# EAGLE design smarthalo_BRAIN_no_usb (EAGLE 6.5.0)
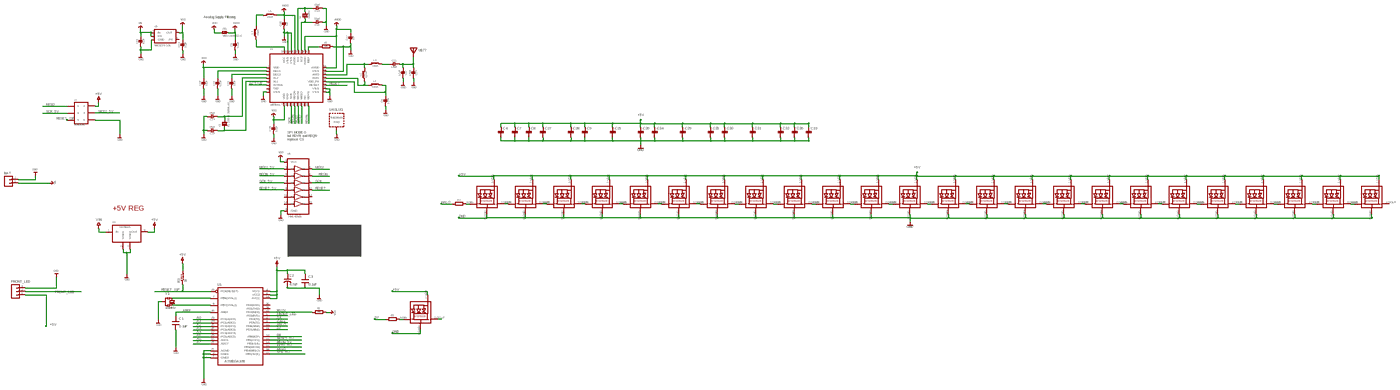
[diagram p0: schematic, sheet 1, overview]
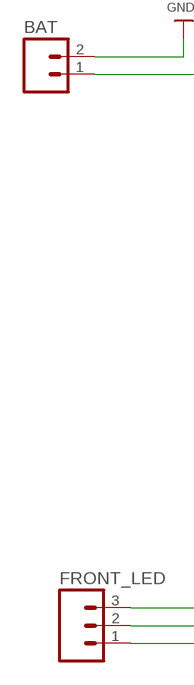
[diagram p1: schematic, sheet 1, part 1 of 4]
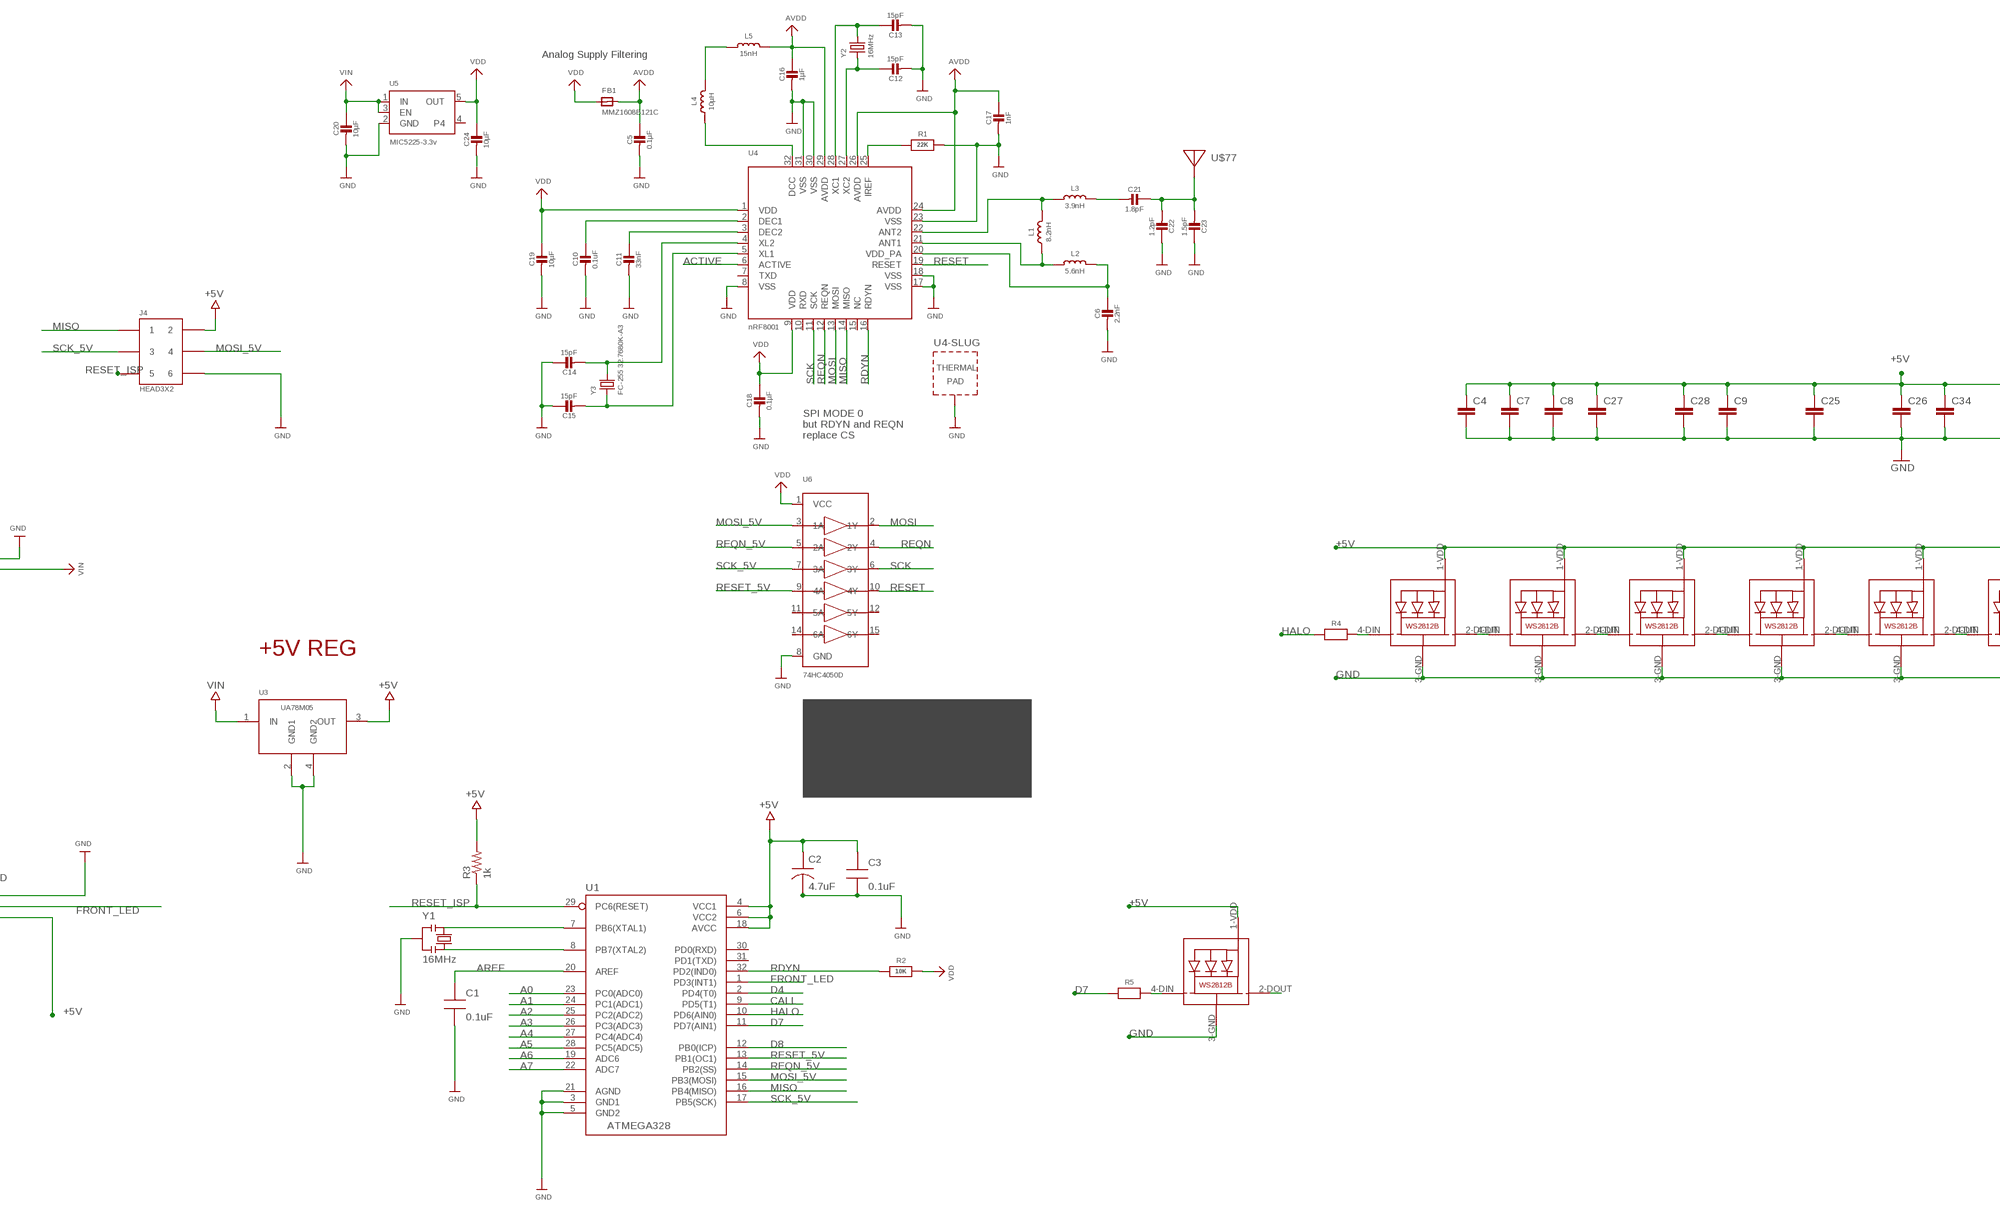
[diagram p2: schematic, sheet 1, part 2 of 4]
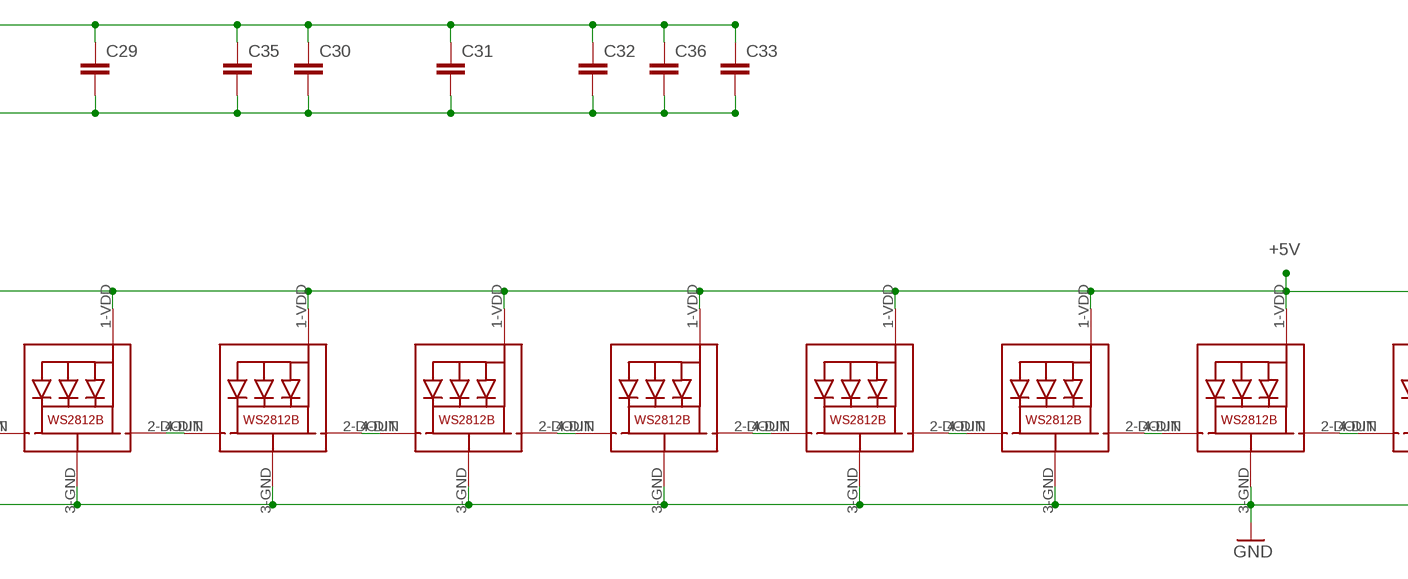
[diagram p3: schematic, sheet 1, part 3 of 4]
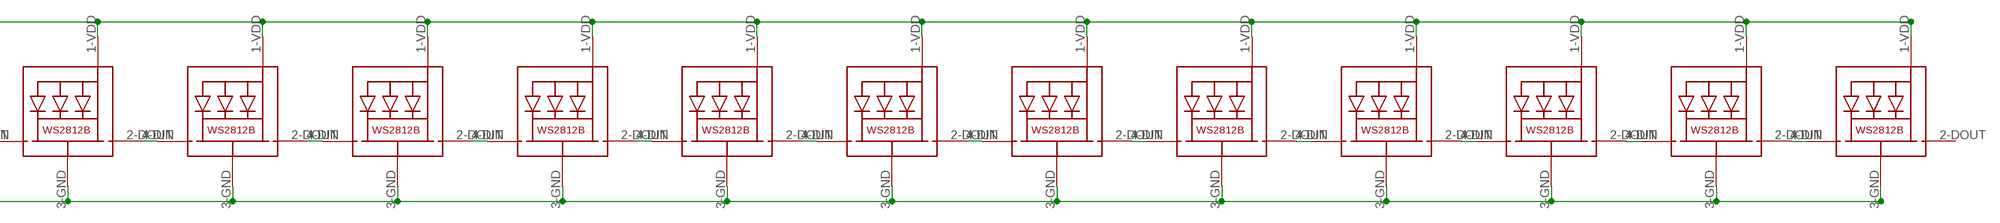
[diagram p4: schematic, sheet 1, part 4 of 4]

## Parts
BAT  M02POLAR_LOCK  [MOLEX-1X2_LOCK]
C1  0.1uF  CAP0805-NP  [CAP0805-NP]
C2  4.7uF  CAP-TANA-P  [TAN-A]
C3  0.1uF  CAP0805-NP  [CAP0805-NP]
C4  C-EUC0603  [C0603]
C5  0.1µF  CAP_CERAMIC0805-NOOUTLINE  [0805-NO]
C6  2.2nF  CAP_CERAMIC_0402  [_0402]
C7  C-EUC0603  [C0603]
C8  C-EUC0603  [C0603]
C9  C-EUC0603  [C0603]
C10  0.1uF  CAP_CERAMIC0805-NOOUTLINE  [0805-NO]
C11  33nF  CAP_CERAMIC0805-NOOUTLINE  [0805-NO]
C12  15pF  CAP_CERAMIC0805-NOOUTLINE  [0805-NO]
C13  15pF  CAP_CERAMIC0805-NOOUTLINE  [0805-NO]
C14  15pF  CAP_CERAMIC0805-NOOUTLINE  [0805-NO]
C15  15pF  CAP_CERAMIC0805-NOOUTLINE  [0805-NO]
C16  1µF  CAP_CERAMIC0805-NOOUTLINE  [0805-NO]
C17  1nF  CAP_CERAMIC_0603  [_0603]
C18  0.1µF  CAP_CERAMIC0805-NOOUTLINE  [0805-NO]
C19  10µF  CAP_CERAMIC0805-NOOUTLINE  [0805-NO]
C20  10µF  CAP_CERAMIC0805-NOOUTLINE  [0805-NO]
C21  1.8pF  CAP_CERAMIC_0402MP  [_0402MP]
C22  1.2pF  CAP_CERAMIC_0402MP  [_0402MP]
C23  1.5pF  CAP_CERAMIC_0402MP  [_0402MP]
C24  10µF  CAP_CERAMIC0805-NOOUTLINE  [0805-NO]
C25  C-EUC0603  [C0603]
C26  C-EUC0603  [C0603]
C27  C-EUC0603  [C0603]
C28  C-EUC0603  [C0603]
C29  C-EUC0603  [C0603]
C30  C-EUC0603  [C0603]
C31  C-EUC0603  [C0603]
C32  C-EUC0603  [C0603]
C33  C-EUC0603  [C0603]
C34  C-EUC0603  [C0603]
C35  C-EUC0603  [C0603]
C36  C-EUC0603  [C0603]
FB1  MMZ1608B121C  FERRITE0805  [0805]
FRONT_LED  M03PTH  [1X03]
J4  HEAD3X2  [HEAD3X2]
L1  8.2nH  INDUCTOR_0402  [_0402]
L2  5.6nH  INDUCTOR_0402  [_0402]
L3  3.9nH  INDUCTOR_0402  [_0402]
L4  10µH  INDUCTOR_0603  [_0603]
L5  15nH  INDUCTOR_0603  [_0603]
LED1  WS2812B5050  [WS2812B]
LED2  WS2812B5050  [WS2812B]
LED3  WS2812B5050  [WS2812B]
LED4  WS2812B5050  [WS2812B]
LED5  WS2812B5050  [WS2812B]
LED6  WS2812B5050  [WS2812B]
LED7  WS2812B5050  [WS2812B]
LED8  WS2812B5050  [WS2812B]
LED9  WS2812B5050  [WS2812B]
LED10  WS2812B5050  [WS2812B]
LED11  WS2812B5050  [WS2812B]
LED12  WS2812B5050  [WS2812B]
LED13  WS2812B5050  [WS2812B]
LED14  WS2812B5050  [WS2812B]
LED15  WS2812B5050  [WS2812B]
LED16  WS2812B5050  [WS2812B]
LED17  WS2812B5050  [WS2812B]
LED18  WS2812B5050  [WS2812B]
LED19  WS2812B5050  [WS2812B]
LED20  WS2812B5050  [WS2812B]
LED21  WS2812B5050  [WS2812B]
LED22  WS2812B5050  [WS2812B]
LED23  WS2812B5050  [WS2812B]
LED24  WS2812B5050  [WS2812B]
LED25  WS2812B5050  [WS2812B]
R1  22K  RESISTOR_0805MP  [_0805MP]
R2  10K  RESISTOR0805_NOOUTLINE  [0805-NO]
R3  1k  RESISTOR0805-RES  [0805]
R4  RESISTOR_0603_NOOUT  [0603-NO]
R5  RESISTOR_0603_NOOUT  [0603-NO]
U1  ATMEGA328  ATMEGA168-20AU  [QFP032]
U3  UA78M05  [SOT223]
U4  nRF8001  NRF8001  [QFN32_5MM]
U5  MIC5225-3.3v  VREG_SOT23-5  [SOT23-5]
U6  74HC4050D  74HC4050DTSSOP  [TSSOP16]
U$77  ANTENNA_PCBNRF8001_1.6MM  [ANT_PCB_2.4GHZ_NRF8001_1.6MM_1OZ]
Y1  16MHz  RESONATORMU  [RESONATOR]
Y2  16MHz  CRYSTAL2.5X2.0  [CRYSTAL_2.5X2]
Y3  FC-255 32.7680K-A3  CRYSTAL4.9X1.8  [CRYSTAL_4.9X1.8]

## Nets
+5V: C2.1 C3.1 C4.1 C7.1 C8.1 C9.1 C25.1 C26.1 C27.1 C28.1 C29.1 C30.1 C31.1 C32.1 C33.1 C34.1 C35.1 C36.1 FRONT_LED.1 J4.2 LED1.1-VDD(VDD) LED2.1-VDD(VDD) LED3.1-VDD(VDD) LED4.1-VDD(VDD) LED5.1-VDD(VDD) LED6.1-VDD(VDD) LED7.1-VDD(VDD) LED8.1-VDD(VDD) LED9.1-VDD(VDD) LED10.1-VDD(VDD) LED11.1-VDD(VDD) LED12.1-VDD(VDD) LED13.1-VDD(VDD) LED14.1-VDD(VDD) LED15.1-VDD(VDD) LED16.1-VDD(VDD) LED17.1-VDD(VDD) LED18.1-VDD(VDD) LED19.1-VDD(VDD) LED20.1-VDD(VDD) LED21.1-VDD(VDD) LED22.1-VDD(VDD) LED23.1-VDD(VDD) LED24.1-VDD(VDD) LED25.1-VDD(VDD) R3.2 U1.4(VCC1) U1.6(VCC2) U1.18(AVCC) U3.3(OUT)
A0: U1.23(PC0(ADC0))
A1: U1.24(PC1(ADC1))
A2: U1.25(PC2(ADC2))
A3: U1.26(PC3(ADC3))
A4: U1.27(PC4(ADC4))
A5: U1.28(PC5(ADC5))
A6: U1.19(ADC6)
A7: U1.22(ADC7)
ACTIVE: U4.6(ACTIVE)
AREF: C1.1 U1.20(AREF)
AVDD: C5.1 C16.1 C17.1 FB1.2 L5.2 U4.24(AVDD) U4.26(AVDD) U4.29(AVDD)
CALL: U1.9(PD5(T1))
D4: U1.2(PD4(T0))
D7: R5.1 U1.11(PD7(AIN1))
D8: U1.12(PB0(ICP))
FRONT_LED: FRONT_LED.2 U1.1(PD3(INT1))
GND: BAT.2 C1.2 C2.2 C3.2 C4.2 C5.2 C6.2 C7.2 C8.2 C9.2 C10.2 C11.2 C12.2 C13.2 C14.1 C15.1 C16.2 C17.2 C18.2 C19.2 C20.2 C22.1 C23.1 C24.2 C25.2 C26.2 C27.2 C28.2 C29.2 C30.2 C31.2 C32.2 C33.2 C34.2 C35.2 C36.2 FRONT_LED.3 J4.6 LED1.3-GND(GND) LED2.3-GND(GND) LED3.3-GND(GND) LED4.3-GND(GND) LED5.3-GND(GND) LED6.3-GND(GND) LED7.3-GND(GND) LED8.3-GND(GND) LED9.3-GND(GND) LED10.3-GND(GND) LED11.3-GND(GND) LED12.3-GND(GND) LED13.3-GND(GND) LED14.3-GND(GND) LED15.3-GND(GND) LED16.3-GND(GND) LED17.3-GND(GND) LED18.3-GND(GND) LED19.3-GND(GND) LED20.3-GND(GND) LED21.3-GND(GND) LED22.3-GND(GND) LED23.3-GND(GND) LED24.3-GND(GND) LED25.3-GND(GND) R1.2 U1.3(GND1) U1.5(GND2) U1.21(AGND) U3.2(GND1) U3.4(GND2) U4.8(VSS) U4.17(VSS) U4.18(VSS) U4.23(VSS) U4.30(VSS) U4.31(VSS) U4.33(TP) U5.2(GND) U6.8(GND) Y1.2
HALO: R4.1 U1.10(PD6(AIN0))
MISO: J4.1 U1.16(PB4(MISO)) U4.14(MISO)
MOSI: U4.13(MOSI) U6.2(1Y)
MOSI_5V: J4.4 U1.15(PB3(MOSI)) U6.3(1A)
N$1: U1.8(PB7(XTAL2)) Y1.3
N$2: U1.7(PB6(XTAL1)) Y1.1
N$3: LED1.2-DOUT(DO) LED2.4-DIN(DI)
N$4: LED2.2-DOUT(DO) LED3.4-DIN(DI)
N$5: LED3.2-DOUT(DO) LED4.4-DIN(DI)
N$6: LED4.2-DOUT(DO) LED5.4-DIN(DI)
N$7: LED5.2-DOUT(DO) LED6.4-DIN(DI)
N$8: LED6.2-DOUT(DO) LED7.4-DIN(DI)
N$9: LED7.2-DOUT(DO) LED8.4-DIN(DI)
N$10: LED8.2-DOUT(DO) LED9.4-DIN(DI)
N$11: LED9.2-DOUT(DO) LED10.4-DIN(DI)
N$12: LED10.2-DOUT(DO) LED11.4-DIN(DI)
N$13: LED11.2-DOUT(DO) LED12.4-DIN(DI)
N$14: LED12.2-DOUT(DO) LED13.4-DIN(DI)
N$15: LED13.2-DOUT(DO) LED14.4-DIN(DI)
N$16: LED14.2-DOUT(DO) LED15.4-DIN(DI)
N$17: LED15.2-DOUT(DO) LED16.4-DIN(DI)
N$18: LED16.2-DOUT(DO) LED17.4-DIN(DI)
N$19: LED17.2-DOUT(DO) LED18.4-DIN(DI)
N$20: LED18.2-DOUT(DO) LED19.4-DIN(DI)
N$21: LED19.2-DOUT(DO) LED20.4-DIN(DI)
N$22: LED20.2-DOUT(DO) LED21.4-DIN(DI)
N$23: LED21.2-DOUT(DO) LED22.4-DIN(DI)
N$24: LED22.2-DOUT(DO) LED23.4-DIN(DI)
N$25: LED23.2-DOUT(DO) LED24.4-DIN(DI)
N$26: LED25.2-DOUT(DO)
N$27: LED25.4-DIN(DI) R5.2
N$28: C6.1 L2.2 U4.20(VDD_PA)
N$29: C11.1 U4.3(DEC2)
N$30: C10.1 U4.2(DEC1)
N$31: C13.1 U4.28(XC1) Y2.3
N$32: C12.1 U4.27(XC2) Y2.1
N$33: C14.2 U4.4(XL2) Y3.2
N$34: C15.2 U4.5(XL1) Y3.1
N$35: L4.1 U4.32(DCC)
N$36: R1.1 U4.25(IREF)
N$37: L4.2 L5.1
N$38: L1.2 L3.1 U4.22(ANT2)
N$39: L1.1 L2.1 U4.21(ANT1)
N$40: C21.2 L3.2
N$41: C21.1 C22.2 C23.2 U$77.FEED
N$42: LED1.4-DIN(DI) R4.2
RDYN: R2.1 U1.32(PD2(IND0)) U4.16(RDYN)
REQN: U4.12(REQN) U6.4(2Y)
REQN_5V: U1.14(PB2(SS)) U6.5(2A)
RESET: U4.19(RESET) U6.10(4Y)
RESET_5V: U1.13(PB1(OC1)) U6.9(4A)
RESET_ISP: J4.5 R3.1 U1.29(PC6(RESET))
SCK: U4.11(SCK) U6.6(3Y)
SCK_5V: J4.3 U1.17(PB5(SCK)) U6.7(3A)
VDD: C18.1 C19.1 C24.1 FB1.1 R2.2 U4.1(VDD) U4.9(VDD) U5.5(OUT) U6.1(VCC)
VIN: BAT.1 C20.1 U3.1(IN) U5.1(IN) U5.3(EN)
Unconnected: LED24.2-DOUT(DO) U1.30(PD0(RXD)) U1.31(PD1(TXD)) U4.7(TXD) U4.10(RXD) U4.15(NC) U5.4 U6.11(5A) U6.12(5Y) U6.14(6A) U6.15(6Y)

## Notes on the sheet
- Analog Supply Filtering
- SPI MODE 0
- but RDYN and REQN
- replace CS
- +5V REG
- SCK_5V ------> DIGITAL13
  MISO     ------> DIGITAL 12
  MOSI_5V ----> DIGITAL 11
  REQN_5V ----> DIGITAL 10
  RDYN      -----> DIGITAL 2
  ACTIVE    -----> NOT CONNECTED
  RESET_5V ----> DIGITAL 9

## Library data of the parts
BAT = SparkFun-Connectors:M02: Standard 2-pin 0.1" header. Use with - straight break away headers ( PRT-00116) - right angle break away headers (PRT-00553) - swiss pins (PRT-00743) - machine pins (PRT-00117) - female headers (PRT-00115) Molex polarized connector foot print use with: PRT-08233 with associated crimp pins and housings. 2.54_SCREWTERM for use with PRT-10571. 3.5mm Screw Terminal footprints for PRT-08084 5mm Screw Terminal footprints for use with PRT-08433
C1 C3 = MySMD:CAP0805-NP
C2 = MySMD:CAP-TANA-P
C4 C7-C9 C25-C36 = rcl:C-EU: CAPACITOR, European symbol
C5 C6 C10-C24 = microbuilder:CAP_CERAMIC: Ceramic Capacitors For new designs, use the packages preceded by an '_' character since they are more reliable: The following footprints should be used on most boards: _0402 - Standard footprint for regular board layouts _0603 - Standard footprint for regular board layouts _0805 - Standard footprint for regular board layouts _1206 - Standard footprint for regular board layouts For extremely tight-pitch boards where space is at a premium, the following 'micro-pitch' footprints can be used (smaller pads, no silkscreen outline, etc.): _0402MP - Micro-pitch footprint for very dense/compact boards _0603MP - Micro-pitch footprint for very dense/compact boards _0805MP - Micro-pitch footprint for very dense/compact boards _1206MP - Micro-pitch footprint for very dense/compact boards
FB1 = microbuilder:FERRITE: Ferrite Bead 0603 MMZ1608B121C - 120 Ohm @ 100MHz, 600mA, 0.15 Ohm DC Resistance - Digikey: 445-2164-1-ND BK1608HW121-T - 120 Ohm, 600mA Ferrite Chip - Digikey: 587-1876-2-ND 0805 HZ0805B272R-10 - 2.7K Ohm @ 100MHz, 200mA, 0.8 Ohm DC Resistance - Digikey: 240-2504-1-ND (see also Murata BLM21BD272SN1L) MMZ2012Y152B - 1.5K Ohm @ 100MHz, 500mA, 0.4 Ohm DC Resistance - Digikey: 445-1560-1-ND - Mainly for high frequency (80-400MHz) MMZ2012R102A - 1K Ohm @ 100MHz, 500mA, 0.3 Ohm DC Resistance - Digikey: 445-1555-2-ND - More general purpose (10-200MHz)
FRONT_LED = SparkFun-Connectors:M03: Header 3 Standard 3-pin 0.1" header. Use with straight break away headers (SKU : PRT-00116), right angle break away headers (PRT-00553), swiss pins (PRT-00743), machine pins (PRT-00117), and female headers (PRT-00115). Molex polarized connector foot print use with SKU : PRT-08232 with associated crimp pins and housings.
J4 = MyCON2:HEAD3X2
L1-L5 = microbuilder:INDUCTOR: Inductors 0603: 10nH Ceramic Inductor - microwire antenna/RF (Digikey: 712-1434-2-ND) 0805: 560nH Ceramic Inductor - RF (Digikey: 553-1047-1-ND) 270nH Ceramic Inductor - Q = 40@250MHz, +-5%, 1 Ohm DC Resistance (Digikey: 535-10506-2-ND) 1007 (2518 Metric) SMT: 10µH 10% 250mOhm 820mA 1007 Inductor (Digikey: 587-2189-1-ND) 22µH 10% 500mOhm 580mA 1007 Inductor (Digikey: 587-2190-1-ND) 47µH 10% 950mOhm 420mA 1007 Inductor (Digikey: 587-2191-1-ND) 47µH 5% 100mOhm 1A 1008 Inductor (Digikey: 732-1816-1-ND) 5.0x5.0mm (Taiyo Yuden NR5040 Series) 6.8µH 20% 2.3A 64mOhm Inductor (Digikey: 587-2374-2-ND) 5.0x5.0mm (TDK VLC5045 Series) 4.7µH 20% 3.3A 34mOhm Inductor (Digikey: 445-6526-1-ND) 6.8µH 20% 2.7A 46mOhm Inductor (Digikey: 445-6527-1-ND) 6.0x6.0mm (TDK VLC6045 Series) 4.7µH 20% 3.8A 27mOhm Inductor (Digikey: 445-6538-2-ND) 6.8µH 20% 3A 41mOhm Inductor (Digikey: 445-6540-1-ND) 6.2µH 30% 2.2A 45mOhm Inductor (Digikey: SRR5028-6R2YCT-ND) - Not TDK VLC6045 but footprint should match 6.0x6.0mm (TDK SLF6045 Series) 6.8uH 30% 2A 33mOhm Inductor (Digikey: 445-4572-1-ND, Mouser: 810-SLF645T6R8N2R0PF) 6.0x6.0mm (Sumida CDRH5D28 Series) 6.2uH 30% 1.8A 45mOhm Inductor (Digikey: 308-1542-1-ND) Taiyo Yuden NR3015T2R2M - 2.2uH 20% 1.5A (Digikey: 587-1648-2-ND, Mouser: 963-NR3015T2R2M) - Used with TI TPS62172 CoilCraft RFID Transponder Coil - MA5532-AE (For use with AS3935 Lightning Sensor)
LED1-LED25 = microbuilder:WS2812B5050
R1 R2 R4 R5 = microbuilder:RESISTOR: Resistors For new designs, use the packages preceded by an '_' character since they are more reliable: The following footprints should be used on most boards: _0402 - Standard footprint for regular board layouts _0603 - Standard footprint for regular board layouts _0805 - Standard footprint for regular board layouts _1206 - Standard footprint for regular board layouts For extremely tight-pitch boards where space is at a premium, the following 'micro-pitch' footprints can be used (smaller pads, no silkscreen outline, etc.): _0402MP - Micro-pitch footprint for very dense/compact boards _0603MP - Micro-pitch footprint for very dense/compact boards _0805MP - Micro-pitch footprint for very dense/compact boards _1206MP - Micro-pitch footprint for very dense/compact boards
R3 = SparkFun-Passives:RESISTOR: Resistor Basic schematic elements and footprints for 0603, 1206, and PTH resistors.
U1 = MySMD:ATMEGA168-20AU
U3 = MySMD:UA78M05
U4 = microbuilder:NRF8001: nRF8001 - Bluetooth Low-Energy Transceiver VDD: 1.9-3.6V Temp: -40°C - 85°C
U5 = microbuilder:VREG_SOT23-5: SOT23-5 Fixed Voltage Regulators Part Current Out V Out V In V Dropout θJA (°C/W) TJ (°C) Digikey Part No. ADP121 150mA 3.3V 3.4-5.5V 0.09V @ 150mA -- -- ADP121-AUJZ33R7CT-ND ADP121 150mA 3.0V 3.1-5.5V 0.09V @ 150mA -- -- ADP121-AUJZ30R7CT-ND ADP122 300mA 3.3V 3.4-5.5V 0.085V @ 300mA -- -- ADP122AUJZ-3.3-R7CT-ND ADP1712 300mA 3.3V 3.5-5.5V 0.17V @ 300mA -- -- ADP1712AUJZ-3.3-R7TR-ND AP7311 (Low Cost) 150mA 3.3V 3.5-6V 0.15V @ 150mA -- -- AP7311-33WG-7DICT-ND LD39015M18R 150mA 1.8V 1.9V-5.5V 0.08V @ 100mA -- -- 497-6977-1-ND LP2985A-33DBVR 150mA 3.3V 3.3-16V 0.28V @ 150mA 206 150 296-18479-1-ND MCP1824T-3302E/OT 300mA 3.3V 3.5V-6V 0.2V @ 300mA -- -- MCP1824T-3302E/OTCT-ND MIC5205-2.5YM5 TR 150mA 2.5V 2.7-16V 0.165V @ 150mA -- -- 576-1257-2-ND MIC5205-3.0YM5 TR 150mA 3.0V 3.2V-16V 0.165V @ 150mA -- -- 576-1258-2-ND MIC5205-3.3YM5 TR 150mA 3.3V 3.5V-16V 0.165V @ 150mA -- -- 576-1259-2-ND TPS780330220 150mA 3.3V+2.2V 3.6-5.5V 250mV Max -- -- 296-23332-1-ND TDA3663/N1,135 100mA 3.3V 3.5-45V 0.18V @ 50mA -- -- 568-5343-1-ND Max operating temp can be calculated using θJA, TJ (max junction temperature), and power in watts. Set the "Maximum Ambient Temperature" until it reaches TJ ("Max Junction Temperature"), which is the absolute limit for safe use of the regulator: Heat Sink Temperature Calculator <http://www.daycounter.com/Calculators/Heat-Sink-Temperature-Calculator.phtml> For example, With 12V source into a 3.3V LP2985 and a 30mA load, we are dissipating (12V-3.3V) * 0.03A = 0.261W. With a θJA of 206 °C/W, a TJ of 150°C, and 261mW we can safely use the chip without a heat sink up to 75°C (=147.1°C Junction Temperature).
U6 = microbuilder:74HC4050D: 6-channel level shifter 74HC4050D - 2V-6V Supply SOIC16 Digikey: 74HC4050D,653-ND Mouser: 771-74HC4050D-T TSSOP16 Digikey: 296-9215-1-ND Mouser:
U$77 = microbuilder:ANTENNA_PCB: Various pre-calculated PCB Antennas NRF8001 1.6mm 1Oz - 2.4GHz PCB antenna for 1.6mm PCBs with 1oz copper, double-sided boards (no GND plan beneath antenna). See nRF2740 production files for further information and impedance matching network. 868MHz/2.4GHz DUALBAND - Dual 868MHz and 2.4GHz centered antenna based on board #6 of the CC-ANTENNA-DK from Chipcon/TI
Y1 = MySMD2:RESONATOR
Y2 Y3 = microbuilder:CRYSTAL: Crystals HC49UP - Surface Mount Crystal 4.0MHz 18pF +/-30ppm Surface Mount Crystal [Digikey: 535-9857-1-ND] 12.0 MHz Surface Mount Crystal [Digikey: 535-9869-6-ND] 25.0 MHz Surface Mount Crystal [Digikey: 535-9078-1-ND] 2.5 x 2.0mm - MEMs SMT Crystal 16.0 MHz 10pF 20ppm 2.5 x 2.0mm Crystal [Digikey -40-85°C: 535-10923-1-ND] 3.2 x 2.5mm - MEMs SMT Crystal 12.0 MHz 8pF 15ppm 3.2 x 2.5mm Crystal [Digikey: -10-70°C: 644-1047-1-ND -40-125°C: 644-1128-1-ND] 40~85°C cheaper: 644-1173-6-ND 16.0 MHz 8pF 15ppm 3.2 x 2.5mm Crystal [Digikey: -10-70°C: 644-1049-1-ND -40-125°C: 644-1129-2-ND]-40~85°C cheaper: 644-1175-6-ND 16.0 MHz 10pF 10ppm 3.2 x 2.5mm Crystal [Digikey: 644-1100-1-ND] 27.12 MHz 18pF 30ppm 3.2 x 2.5mm Crystal [Digikey: 887-1424-1-ND] 27.12MHz 10pF 10ppm 3.2 x 2.5mm Crystal [Digikey: 887-1329-1-ND] 4.9 x 1.8mm - MEMs SMT Crystal 32.768 KHz 12.5pF 20ppm 4.9 x 1.8mm Crystal [Digikey: SE2415CT-ND] 8.0 x 3.8mm - Surface Mount Crystal 32.768kHz 12.5pF 20ppm -40°C-85°C [Digikey: 535-9166-2-ND] Cylinder 32.768KHz Cylinder Crystal (2x6mm body) [Ex. Digikey: 300-8341-2-ND]

## Board
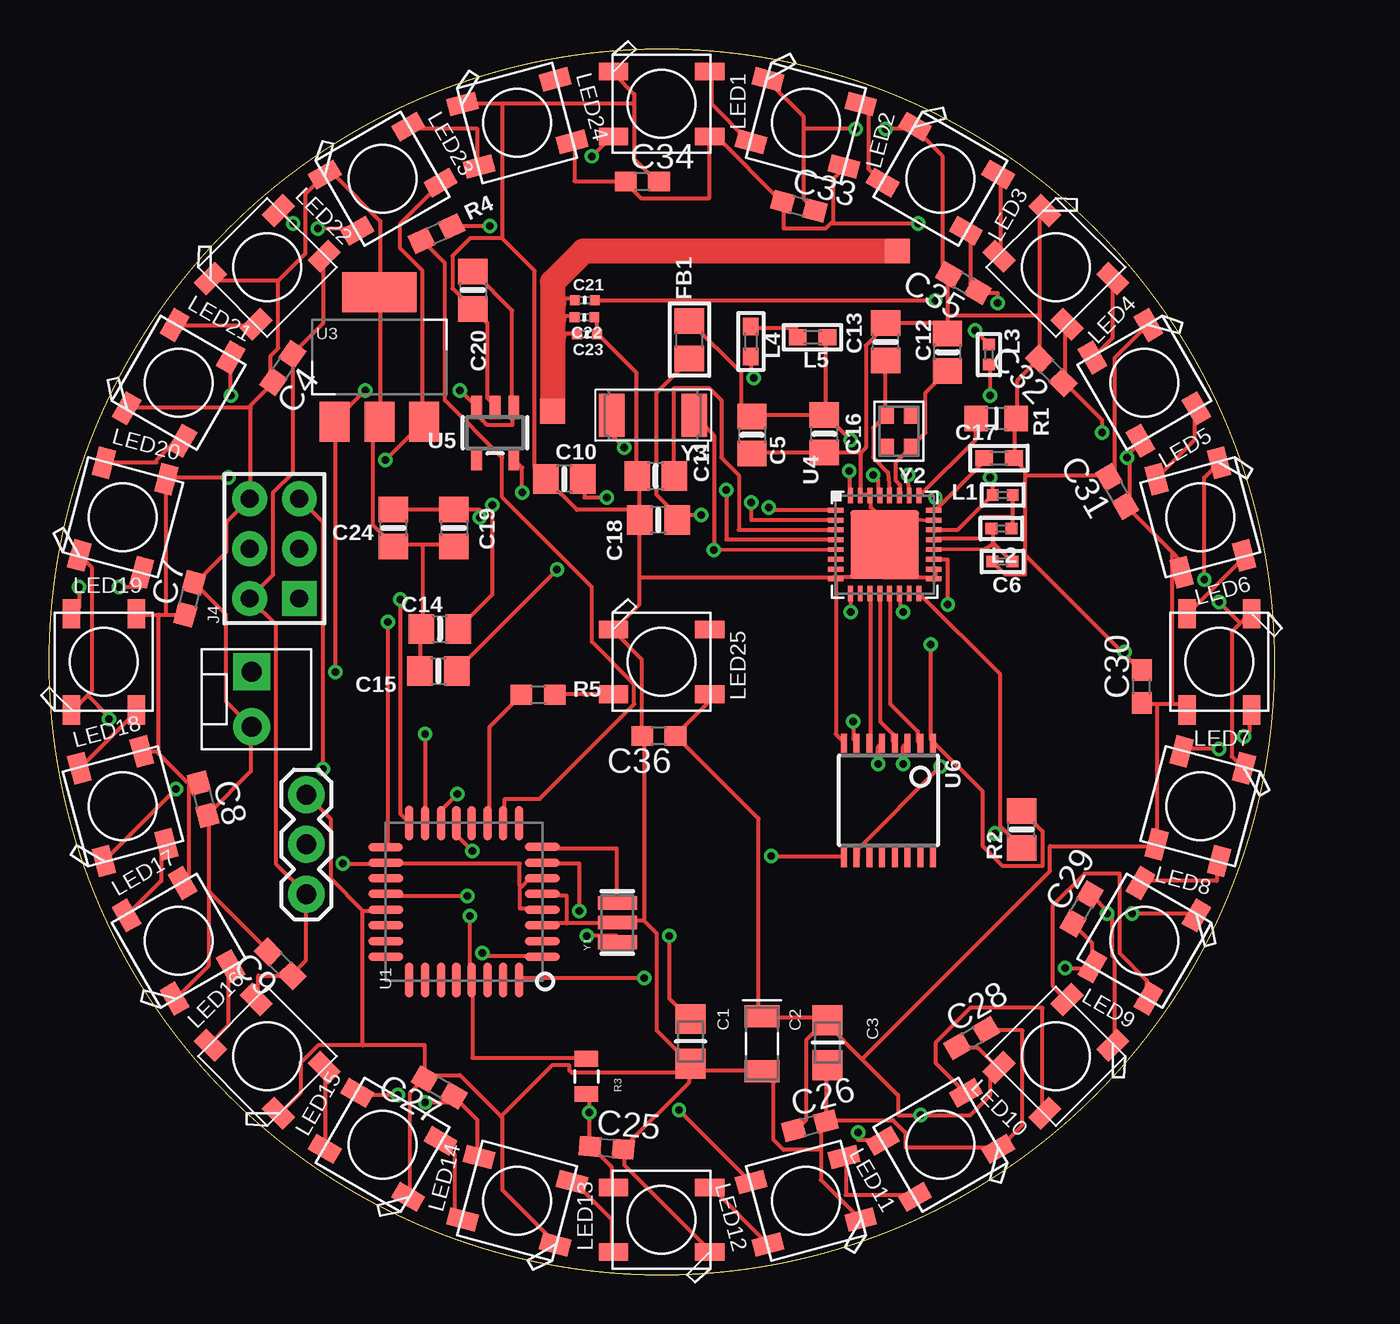
[diagram p5: board, top side]
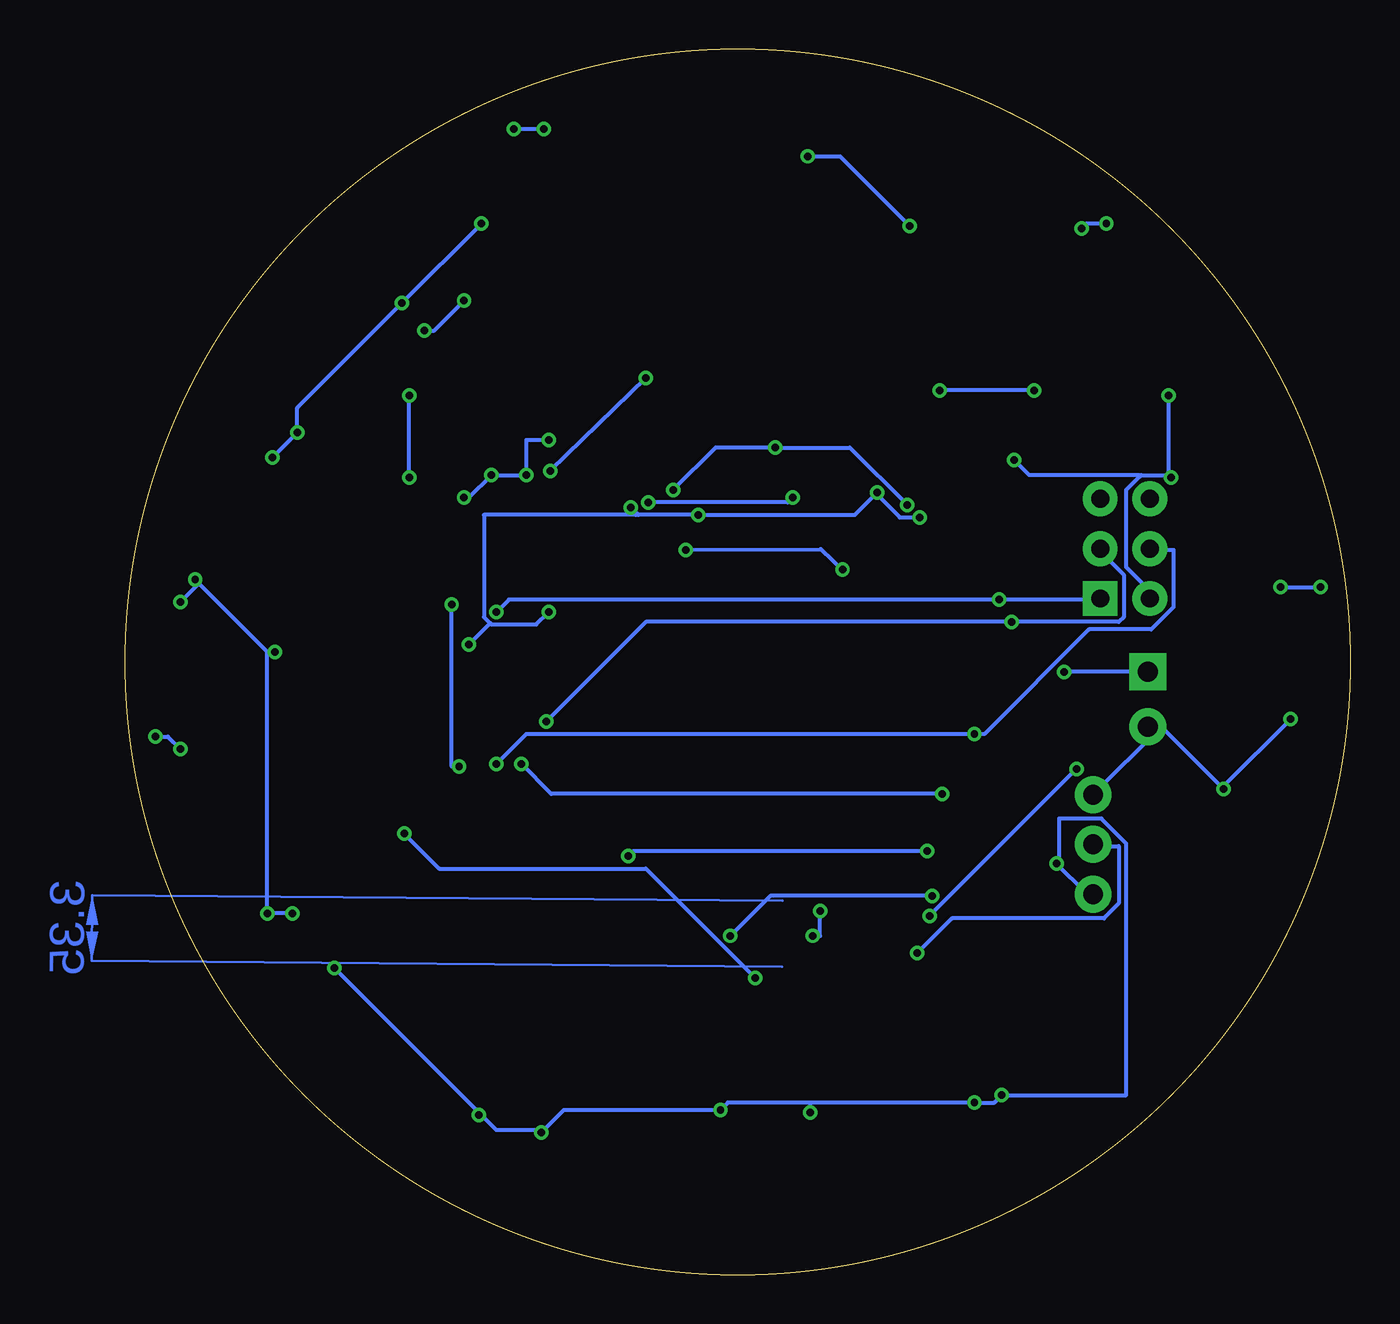
[diagram p6: board, bottom side, seen from below]

Size 62.5 x 62.5 mm. Coordinates in mm from the lower left corner, seen from the top.
Outline: circle at 31.25,31.25 radius 31.25
Copper layers (1*16): Top 0.0356mm / dielectric 1.5011mm / Bottom 0.0356mm
Design rules "LaenPCBOrder *": minimum track width 8mil, minimum drill 15mil, track to track 6mil, track to pad 6mil, pad to pad 6mil, via to via 6mil, smd to smd 6mil, copper to edge 15mil, drill to drill 6mil, minimum pad ring 7mil, minimum via ring 7mil, stop-mask expansion 3mil, vias tented up to drill 0mil, thermal gap 10mil

### Footprints (pad centres in the part's own frame; a part is rotated, then mirrored left to right if it is on the bottom)
MOLEX-1X2_LOCK = drill 1.016 pad 1.88 square: 1 -0.127,0 | drill 1.016 pad 1.88: 2 2.667,0
CAP0805-NP = smd 1.524 x 1.524: 1 0,0; 2 2.286,0
TAN-A = smd 1.118 x 1.778: 1 0,0; 2 2.794,0
C0603 = smd 1.1 x 1: 1 -0.85,0; 2 0.85,0
0805-NO = smd 1.3 x 1.5: 1 -0.95,0; 2 0.95,0
_0402 = smd 0.6 x 0.6: 1 -0.508,0; 2 0.508,0
_0603 = smd 0.9 x 0.8: 1 -0.762,0; 2 0.762,0
_0402MP = smd 0.5 x 0.5: 1 -0.508,0; 2 0.508,0
0805 = smd 1.3 x 1.5: 1 -0.95,0; 2 0.95,0
1X03 = drill 1.016 pad 1.88: 1 0,0; 2 2.54,0; 3 5.08,0
HEAD3X2 = drill 0.914 pad 1.778 square: 1 0,0 | drill 0.914 pad 1.778: 2 0,2.54; 3 2.54,0; 4 2.54,2.54; 5 5.08,0; 6 5.08,2.54
WS2812B = smd 1.5 x 0.9: 1-VDD 2.45,-1.65; 2-DOUT 2.45,1.65; 3-GND -2.45,1.65; 4-DIN -2.45,-1.65
_0805MP = smd 1.2 x 1.3: 1 -1.016,0; 2 1.016,0
0805' = smd 0.8 x 1.2: 1 -0.9,0; 2 0.9,0
0603-NO = smd 1.1 x 1: 1 -0.85,0; 2 0.85,0
QFP032 = smd 0.432 x 1.778: 1 0,0; 2 0.8,0; 3 1.599,0; 4 2.399,0; 5 3.199,0; 6 3.998,0; 7 4.798,0; 8 5.598,0; 17 5.588,8.001; 18 4.798,7.997; 19 3.998,7.997; 20 3.199,7.997; 21 2.399,7.997; 22 1.599,7.997; 23 0.799,7.997; 24 0,7.997 | smd 1.778 x 0.432: 9 6.807,1.194; 10 6.807,2.007; 11 6.807,2.794; 12 6.807,3.607; 13 6.807,4.394; 14 6.807,5.182; 15 6.807,5.994; 16 6.816,6.803; 25 -1.194,6.807; 26 -1.194,5.994; 27 -1.194,5.182; 28 -1.194,4.394; 29 -1.194,3.607; 30 -1.194,2.794; 31 -1.194,2.007; 32 -1.194,1.194
SOT223 = smd 1.524 x 2.032: 1 0,0; 2 2.286,0; 3 4.572,0 | smd 3.81 x 2.032: 4 2.286,6.604
QFN32_5MM = smd 0.8 x 0.25: 1 -2.5,1.75; 2 -2.5,1.25; 3 -2.5,0.75; 4 -2.5,0.25; 5 -2.5,-0.25; 6 -2.5,-0.75; 7 -2.5,-1.25; 8 -2.5,-1.75; 17 2.5,-1.75; 18 2.5,-1.25; 19 2.5,-0.75; 20 2.5,-0.25; 21 2.5,0.25; 22 2.5,0.75; 23 2.5,1.25; 24 2.5,1.75 | smd 0.25 x 0.8: 9 -1.75,-2.5; 10 -1.25,-2.5; 11 -0.75,-2.5; 12 -0.25,-2.5; 13 0.25,-2.5; 14 0.75,-2.5; 15 1.25,-2.5; 16 1.75,-2.5; 25 1.75,2.5; 26 1.25,2.5; 27 0.75,2.5; 28 0.25,2.5; 29 -0.25,2.5; 30 -0.75,2.5; 31 -1.25,2.5; 32 -1.75,2.5 | smd 3.5 x 3.5: 33 0,0
SOT23-5 = smd 0.55 x 1.2: 1 -0.95,-1.3; 2 0,-1.3; 3 0.95,-1.3; 4 0.95,1.3; 5 -0.95,1.3
TSSOP16 = smd 0.305 x 0.991: 1 -2.275,-2.918; 2 -1.625,-2.918; 3 -0.975,-2.918; 4 -0.325,-2.918; 5 0.325,-2.918; 6 0.975,-2.918; 7 1.625,-2.918; 8 2.275,-2.918; 9 2.275,2.918; 10 1.625,2.918; 11 0.975,2.918; 12 0.325,2.918; 13 -0.325,2.918; 14 -0.975,2.918; 15 -1.625,2.918; 16 -2.275,2.918
ANT_PCB_2.4GHZ_NRF8001_1.6MM_1OZ = smd 1.27 x 1.27: FEED 0,0; TESTPOINT -8.169,17.605
RESONATOR = smd 0.7 x 2: 1 -1,0; 2 0,0; 3 1,0
CRYSTAL_2.5X2 = smd 0.9 x 0.75: 1 -0.825,-0.625; 2 0.825,-0.625; 3 0.825,0.625; 4 -0.825,0.625
CRYSTAL_4.9X1.8 = smd 1.3 x 2.2: 1 -2.1,0; 2 2.1,0

### Placement (x,y rotation side)
BAT  10.33,30.61 270 top
C1  32.72,13.04 270 top
C2  36.37,13.17 270 top
C3  39.72,12.97 270 top
C4  11.93,46.23 235 top
C5  35.86,42.82 270 top
C6  48.64,36.37 180 top
C7  7.17,34.47 75 top
C8  7.87,24.25 285 top
C9  11.79,15.85 135 top
C10  26.29,40.58 180 top
C11  30.95,40.72 180 top
C12  45.83,47.04 90 top
C13  42.68,47.57 90 top
C14  19.94,32.92 0 top
C15  19.86,30.78 0 top
C16  39.54,42.88 270 top
C17  48.46,41.64 0 top
C18  31.09,38.48 180 top
C19  20.66,38.07 270 top
C20  21.63,50.2 270 top
C21  27.33,49.69 0 top
C22  27.31,48.82 180 top
C23  27.45,47.95 180 top
C24  17.56,38.07 270 top
C25  28.45,6.47 355 top
C26  38.81,7.59 15 top
C27  19.91,9.55 150 top
C28  47.07,12.07 30 top
C29  52.67,18.65 60 top
C30  55.75,29.99 90 top
C31  54.49,39.93 120 top
C32  51.13,46.09 135 top
C33  38.25,54.49 345 top
C34  30.27,55.75 0 top
C35  46.65,50.57 150 top
C36  31.11,27.47 180 top
FB1  32.67,47.68 90 top
FRONT_LED  13.13,19.4 90 top
J4  12.77,34.48 90 top
L1  48.65,39.76 180 top
L2  48.58,38.05 180 top
L3  47.95,46.92 90 top
L4  35.8,47.58 90 top
L5  38.95,47.8 0 top
LED1  31.25,59.7 0 top
LED2  38.61,58.73 345 top
LED3  45.47,55.89 330 top
LED4  51.37,51.37 315 top
LED5  55.89,45.47 300 top
LED6  58.73,38.61 285 top
LED7  59.7,31.25 270 top
LED8  58.73,23.89 255 top
LED9  55.89,17.03 240 top
LED10  51.37,11.13 225 top
LED11  45.47,6.61 210 top
LED12  38.61,3.77 195 top
LED13  31.25,2.8 180 top
LED14  23.89,3.77 165 top
LED15  17.03,6.61 150 top
LED16  11.13,11.13 135 top
LED17  6.61,17.03 120 top
LED18  3.77,23.89 105 top
LED19  2.8,31.25 90 top
LED20  3.77,38.61 75 top
LED21  6.61,45.47 60 top
LED22  11.13,51.37 45 top
LED23  17.03,55.89 30 top
LED24  23.89,58.73 15 top
LED25  31.25,31.25 0 top
R1  48.32,43.66 0 top
R2  49.61,22.7 90 top
R3  1k  [0805']  27.42,10.11 270 top
R4  19.77,53.09 25 top
R5  24.95,29.57 0 top
U1  25.17,16.21 90 top
U3  14.57,43.5 0 top
U4  42.63,37.23 0 top
U5  22.76,42.93 180 top
U6  42.82,24.18 180 top
U$77  25.68,44.03 270 top
Y1  29,17.95 90 top
Y2  43.36,43.01 90 top
Y3  30.81,43.82 180 top

### Tracks (layer width: path | path; a pad name or v marks a point on that pad's centre or on a via)
+5V  (via drill 0.38)
  Top 0.203: 26.68,57.79 LED24.1-VDD 26.8,57.67 26.8,55.76 29.34,55.76 C34.1 29.47,55.63 30.23,54.87 33.66,54.87 33.66,58.05 LED1.1-VDD 33.79,58.05 34.04,58.05 37.35,54.75 C33.1 37.47,54.62 37.47,53.35 39.63,53.35 39.95,53.67 | 40.65,56.52 LED2.1-VDD 40.52,56.4 40.01,55.89 40.01,53.73 39.95,53.67 | 57.28,29.09 58.05,29.09 58.05,28.84 LED7.1-VDD | 57.28,29.09 56.52,29.09 | 56.52,29.09 55.76,29.09 C30.1 | 56.52,29.09 56.52,21.98 LED8.1-VDD 56.4,21.85 51.06,21.85 51.06,20.58 41.47,10.99 | 46.74,53.22 LED3.1-VDD 46.87,53.22 47,53.09 47,50.55 47.38,50.17 C35.1 47.51,50.05 48.39,50.05 v48.39,49.54 | 51.95,48.52 LED4.1-VDD 51.82,48.39 51.82,45.6 C32.1 51.82,45.47 53.73,43.57 v53.73,42.93 | 55.76,42.55 LED5.1-VDD 55.63,42.43 55.13,41.92 55.13,41.66 | 57.35,36.77 57.67,36.46 57.67,35.82 LED6.1-VDD 57.79,35.82 | 57.35,36.77 55,39.12 C31.1 55.13,39.12 55.13,41.66 | 55.13,41.66 v55,41.66 | 57.28,29.09 57.28,36.71 57.35,36.77 | v44.33,53.6 40.01,53.6 39.95,53.67 | 5.6,33.66 4.45,33.66 LED19.1-VDD 4.45,33.79 | 5.6,33.66 5.98,33.66 | 5.98,33.66 6.87,33.66 C7.1 | 5.98,33.66 5.98,40.52 LED20.1-VDD 6.1,40.65 v9.15,40.65 | 6.87,19.95 LED17.1-VDD 6.87,20.07 7.12,20.33 7.12,25.15 | 7.12,25.15 6.99,25.15 5.53,26.61 | 7.12,25.15 7.63,25.15 C8.1 7.12,25.15 | 5.53,26.61 5.47,26.68 4.83,26.68 LED18.1-VDD 4.71,26.8 | 5.6,33.66 5.6,26.68 5.53,26.61 | 24.07,19.76 24.52,20.2 25.15,20.2 U1.6 | 24.07,19.76 24.01,19.69 24.01,18.68 25.15,18.68 U1.4 | 24.07,19.76 24.01,19.82 24.01,20.96 17.28,20.96 U1.18 17.15,20.96 v14.99,20.96 | 10.55,14.11 LED16.1-VDD 10.68,14.11 10.68,15.25 12.33,15.25 C9.1 12.45,15.38 13.09,16.01 13.09,19.31 FRONT_LED.1 13.09,19.44 11.57,20.96 11.57,33.16 10.3,34.42 J4.2 10.3,34.55 11.44,35.7 11.44,39.89 12.45,40.9 12.45,46.87 C4.1 12.45,47 13.98,48.52 13.98,51.82 LED22.1-VDD 14.11,51.95
  Top 0.203: LED23.1-VDD 19.95,55.63 17.91,53.6 17.91,52.33 19.06,51.19 19.06,43.57 U3.3 19.06,43.44 v17.15,41.54 | v9.28,44.84 9.28,46.74 LED21.1-VDD | LED25.1-VDD 33.66,29.6 33.66,29.22 32.01,27.57 C36.1 32.01,27.44 36.2,23.25 36.2,13.34 36.33,13.22 C2.1 36.46,13.09 39.63,13.09 C3.1 | C28.1 46.36,11.57 47.38,11.57 48.39,10.55 LED10.1-VDD | 48.52,10.55 LED10.1-VDD | C26.1 38.11,7.37 38.62,7.88 38.62,11.95 39.63,12.96 C3.1 | 41.47,10.99 39.63,12.84 C3.1 | 41.47,10.99 43.31,9.15 43.31,8.14 v44.46,8.14 47,8.14 48.01,9.15 48.01,10.3 48.27,10.55 LED10.1-VDD | R3.2 27.44,9.15 27.57,9.02 v27.57,8.26 27.57,6.61 C25.1 27.69,6.48 28.71,5.47 28.71,4.45 LED13.1-VDD 28.84,4.45 | C29.1 52.33,17.79 53.22,16.9 53.22,15.76 LED9.1-VDD | 53.35,15.76 LED9.1-VDD | 42.55,6.87 LED11.1-VDD 42.43,6.87 41.28,6.87 v41.28,7.25 | 35.82,4.71 LED12.1-VDD 35.7,4.83 v32.14,8.39 | 15.76,9.28 LED15.1-VDD 15.76,9.15 v17.79,9.15 | v19.19,8.77 20.58,8.77 20.58,9.02 C27.1 20.71,9.02 21.85,7.88 21.85,6.1 LED14.1-VDD 21.98,5.98 | v51.82,15.63 53.22,15.63 LED9.1-VDD
  Bottom 0.203: v55,41.66 v53.73,42.93 53.73,44.2 v48.39,49.54 v44.33,53.6 | FRONT_LED.1 13.22,19.44 13.47,19.44 v14.99,20.96 14.87,20.96 14.87,23.25 12.71,23.25 11.44,21.98 11.44,9.15 v17.79,9.15 18.17,8.77 v19.19,8.77 27.57,8.77 | 9.28,40.77 v9.28,44.84 | 9.28,40.77 10.68,40.77 10.74,40.71 | 10.74,40.71 11.44,40.01 11.44,36.08 10.3,34.93 10.3,34.55 J4.2 | v17.15,41.54 16.39,40.77 10.8,40.77 10.74,40.71 | 9.28,40.77 v9.15,40.65 | 27.57,8.77 31.76,8.77 v32.14,8.39 40.14,8.39 v41.28,7.25 41.28,7.37 43.57,7.37 44.39,8.2 | 44.39,8.2 v51.82,15.63 | 27.57,8.77 v27.57,8.26 | v44.46,8.14 44.39,8.2
AREF  (via drill 0.38)
  Top 0.203: v31.63,17.28 31.63,14.11 32.65,13.09 C1.1 | v21.34,19.31 17.28,19.31 U1.20
  Bottom 0.203: v31.63,17.28 29.6,19.31 v21.34,19.31
AVDD  (via drill 0.38)
  Top 0.203: v42.05,40.77 42.3,40.52 42.3,39.76 U4.29 | v43.82,40.77 43.89,39.76 U4.26 43.87,39.54 | 45.54,39.31 47.63,41.41 47.63,41.54 C17.1 | 45.54,39.31 45.22,39 U4.24 | 45.54,39.31 v45.22,39.63 | L5.2 39.63,47.76 39.63,43.95 C16.1 | C16.1 39.51,43.82 35.95,43.82 C5.1 35.82,43.82 35.31,44.33 35.31,45.98 32.77,48.52 FB1.2 | v40.9,42.55 39.63,43.82 C16.1
  Bottom 0.203: v45.22,39.63 44.97,39.63 v43.82,40.77 v42.05,40.77 42.05,42.55 v40.9,42.55
D7
  Top 0.203: R5.1 24.01,29.47 22.49,27.95 22.49,23.12 U1.11
FRONT_LED  (via drill 0.38)
  Top 0.203: v22.11,16.39 22.11,16.26 25.15,16.26 U1.1
  Bottom 0.203: v22.11,16.39 20.33,18.17 12.58,18.17 11.82,18.93 11.82,21.85 13.09,21.85 FRONT_LED.2
GND  (via drill 0.38)
  Top 0.203: C15.1 18.93,30.87 18.93,32.9 C14.1 19.06,33.03 19.06,37.22 | 19.06,37.22 20.58,37.22 C19.2 | 19.06,37.22 17.66,37.22 C24.2 17.53,37.22 16.52,38.23 16.52,43.19 16.77,43.44 U3.2 16.9,43.57 16.9,50.05 U3.4 16.9,50.17 16.9,53.73 14.61,56.02 14.11,56.02 LED23.3-GND | 14.11,56.14 LED23.3-GND | 8.26,50.81 LED22.3-GND 8.26,50.68 11.69,50.68 | 10.3,44.2 10.3,39.63 J4.6 10.17,39.51 9.02,38.36 9.02,36.84 7.5,35.31 C7.2 7.5,35.19 9.02,33.66 9.02,29.22 10.3,27.95 BAT.2 10.3,27.82 10.3,25.66 8.14,23.5 C8.2 8.14,23.38 8.14,19.57 8.2,19.5 | 10.3,44.2 10.3,44.33 11.44,45.47 C4.2 11.31,45.47 11.31,46.87 11.69,47.25 11.69,50.68 | 10.3,44.2 4.07,44.2 LED21.3-GND | 11.69,50.68 13.09,52.08 13.09,55.13 13.98,56.02 LED23.3-GND | 11.69,8.26 LED16.3-GND 11.82,8.26 12.84,9.28 12.84,10.8 13.72,11.69 16.01,11.69 | 25.92,1.53 LED14.3-GND 25.79,1.66 23.12,4.33 23.12,8.01 23.06,8.07 | C27.2 19.06,9.91 18.42,9.28 18.42,4.07 LED15.3-GND 18.3,3.95 | 23.06,8.07 20.96,10.17 19.19,10.17 | 19.19,10.17 19.19,10.04 C27.2 | 16.01,11.69 19.19,11.69 19.19,10.17 | 19.19,10.17 C27.2 | 16.01,18.55 17.15,18.55 U1.21 | 16.01,11.69 16.01,18.55 | 1.15,28.84 LED19.3-GND 1.28,28.84 1.98,29.54 | 1.98,29.54 2.17,29.73 2.17,36.08 1.66,36.58 LED20.3-GND 1.53,36.71 | 2.8,21.22 LED18.3-GND 2.93,21.22 v6.48,24.77 | 8.2,19.5 11.18,16.52 C9.2 | LED17.3-GND 6.48,14.11 8.14,15.76 8.14,19.44 8.2,19.5 | 1.98,29.54 3.06,28.46 v3.06,28.33 | 16.01,18.55 14.36,20.2 14.36,23.25 13.22,24.39 FRONT_LED.3 | 60.97,25.92 LED8.3-GND 60.84,25.92 60.33,26.42 60.33,32.77 60.78,33.22 | 60.78,33.22 61.22,33.66 LED7.3-GND 61.35,33.79 | LED6.3-GND 59.57,41.28 58.94,40.65 v58.94,35.44
  Top 0.203: 58.55,18.3 LED9.3-GND 58.43,18.42 v55.25,18.42 | 54.05,18.49 54.24,18.3 54.24,16.26 54.36,16.14 54.36,11.82 LED10.3-GND 54.36,11.69 | 54.05,18.49 53.22,19.31 C29.2 | v53.98,18.42 54.05,18.49 | v59.7,34.3 60.78,33.22 | C5.2 35.95,41.92 39.51,41.92 C16.2 39.63,41.92 41.41,41.92 | U4.18 45.22,35.95 45.22,35.57 U4.17 45.09,35.57 42.55,35.57 | 41.41,39.76 41.79,39.76 U4.30 41.92,39.63 41.92,39.12 42.68,38.36 | 42.55,35.57 40.14,35.57 U4.8 | 42.55,35.57 42.55,37.22 U4.33 | 42.68,38.36 43.88,38.51 U4.23 | 42.68,38.36 42.68,37.35 U4.33 | 42.68,38.36 U4.33 | 42.55,35.57 U4.33 | U6.8 40.52,27.19 40.14,27.57 40.14,35.44 U4.8 | 41.41,39.76 41.41,41.92 | 41.41,39.76 U4.31 | 38.49,58.43 38.49,59.06 36.71,60.84 LED2.3-GND 36.71,60.97 | 38.49,58.43 38.49,54.87 39,54.36 C33.2 | 44.2,58.55 LED3.3-GND | 45.86,48.52 45.86,48.01 C12.2 45.86,48.52 | 45.86,48.52 45.86,48.9 | 45.86,48.9 45.86,50.94 C35.2 45.86,51.06 45.6,51.32 45.6,57.03 44.2,58.43 LED3.3-GND | 45.86,48.52 42.81,48.52 C13.2 42.68,48.39 41.66,47.38 41.66,42.17 41.41,41.92 | v41.16,58.43 38.49,58.43 | v42.68,58.43 44.08,58.43 LED3.3-GND | 50.81,54.36 LED4.3-GND 50.68,54.24 50.55,54.11 50.55,48.9 | 50.55,48.9 50.55,46.74 C32.2 50.43,46.62 49.41,45.6 49.41,43.7 R1.2 49.28,43.57 49.28,41.66 C17.2 49.28,41.54 49.79,41.03 49.79,40.77 | 56.14,48.39 LED5.3-GND 56.02,48.39 54.36,46.74 54.36,41.03 54.11,40.77 C31.2 53.98,40.77 49.79,40.77 | 49.79,40.77 49.79,36.71 | 49.79,36.71 49.79,35.7 48.78,35.7 48.14,36.33 C6.2 | 49.79,36.71 54.81,31.7 | 54.81,31.7 55.63,30.87 C30.2 | 50.55,48.9 45.86,48.9 | v54.87,31.76 54.81,31.7 | 33.79,1.15 LED13.3-GND 33.66,1.28 29.34,5.6 29.34,6.36 C25.2 29.34,6.48 32.65,9.79 32.65,10.3
  Top 0.203: 32.65,10.42 32.65,10.68 C1.2 | 32.65,10.42 32.65,10.3 | 32.65,10.42 36.33,10.42 C2.2 36.46,10.3 36.97,9.79 36.97,6.87 37.47,6.36 39.38,6.36 | 32.65,10.42 C1.2 | C28.2 47.89,12.45 49.66,12.45 49.66,7.63 48.52,6.48 LED11.3-GND | 48.39,6.36 LED11.3-GND | LED12.3-GND 41.28,2.93 39.38,4.83 39.38,6.36 | 39.63,7.88 39.63,10.68 C3.2 | 39.38,6.36 39.38,7.63 39.51,7.75 C26.2 39.63,7.88 | 39.63,7.88 43.06,7.88 43.7,7.25 43.7,6.48 48.39,6.48 LED11.3-GND | U5.2 22.74,44.33 22.36,44.71 22.36,48.52 21.73,49.16 C20.2 21.6,49.28 20.58,50.3 20.58,51.95 21.47,52.84 23.12,52.84 | LED24.3-GND 21.22,59.7 23.12,59.7 | 29.85,59.7 29.85,60.21 28.84,61.22 LED1.3-GND 28.84,61.35 | 29.85,59.7 29.85,56.9 31,55.76 C34.2 | 29.85,59.7 23.12,59.7 | 23.12,59.7 23.12,52.84 | 26.42,17.91 28.96,17.91 Y1.2 29.09,18.04 30.36,18.04 | 26.42,17.91 25.28,17.91 U1.3 | 26.42,17.91 26.42,19.31 25.28,19.31 U1.5 | C22.1 27.82,48.78 27.95,48.65 27.95,48.01 C23.1 28.07,47.89 29.98,45.98 29.98,40.77 C11.2 30.11,40.65 30.11,39 | 30.11,39 30.11,38.49 C18.2 | 30.11,39 26.93,39 25.41,40.52 C10.2 25.28,40.65 24.77,41.16 24.77,51.19 23.12,52.84 | 30.11,39 C18.2 | 30.11,35.57 30.11,38.36 C18.2 | 30.11,35.57 30.11,34.17 28.84,32.9 LED25.3-GND 28.84,32.77 30.23,31.38 30.23,27.57 C36.2 30.36,27.44 30.36,18.04 | 30.36,18.04 31,17.41 31,12.45 32.65,10.8 C1.2 | 30.11,35.57 40.01,35.57 U4.8 | 23.06,8.07 25.66,10.68 26.55,10.68 26.55,10.42 26.68,10.3 32.65,10.3 | 32.65,10.3 C1.2
  Bottom 0.203: 9.79,27.82 10.3,27.82 BAT.2 9.79,27.82 | 9.79,27.82 9.53,27.82 v6.48,24.77 6.48,24.9 v3.06,28.33 | 9.79,27.82 13.09,24.52 FRONT_LED.3 | v53.98,18.42 v55.25,18.42 55.25,31.76 | 55.25,31.76 v58.94,35.44 58.81,35.19 v59.7,34.3 | v42.68,58.43 v41.16,58.43 | v54.87,31.76 55.25,31.76
HALO
  Top 0.203: R4.1 19.06,52.71 20.2,51.57 20.2,44.59 23.12,41.66 23.12,39.63 27.69,35.06 27.69,32.27 29.85,30.11 29.85,29.09 25.03,24.27 23.25,24.27 23.25,23.12 U1.10
MISO  (via drill 0.38)
  Top 0.203: v43.57,33.79 43.44,33.92 43.44,34.68 U4.14 | v17.91,34.42 17.91,23.5 18.3,23.12 U1.16
  Bottom 0.203: v43.57,33.79 42.93,34.42 v17.91,34.42 12.84,34.42 J4.1
MOSI
  Top 0.203: U4.13 42.93,34.68 42.93,29.09 44.33,27.69 44.33,27.19 U6.2
MOSI_5V  (via drill 0.38)
  Top 0.203: v43.57,26.04 43.57,26.93 43.7,27.06 U6.3 | v19.19,27.57 19.19,23.12 U1.15
  Bottom 0.203: v43.57,26.04 42.05,27.57 v19.19,27.57 18.68,27.57 13.34,32.9 10.17,32.9 9.02,34.04 9.02,36.97 10.17,36.97 J4.4
N$1
  Top 0.203: U1.8 25.28,21.73 28.96,21.73 28.96,19.06 Y1.3
N$2  (via drill 0.38)
  Top 0.203: v27.06,18.55 27.06,20.96 25.28,20.96 U1.7 | v27.44,17.28 28.96,17.28 28.96,17.03 Y1.1
  Bottom 0.203: v27.06,18.55 27.06,17.28 v27.44,17.28
N$3
  Top 0.203: LED2.4-DIN 35.7,57.79 33.79,59.7 33.79,61.22 LED1.2-DOUT
N$4
  Top 0.203: LED3.4-DIN 42.43,55.76 41.79,56.4 41.79,59.19 41.41,59.57 LED2.2-DOUT
N$5
  Top 0.203: LED4.4-DIN 48.52,51.95 48.52,56.02 LED3.2-DOUT
N$6
  Top 0.203: LED5.4-DIN 53.35,46.87 54.24,47.76 54.24,50.68 LED4.2-DOUT
N$7
  Top 0.203: LED6.4-DIN 56.52,40.65 58.43,42.55 58.43,44.08 LED5.2-DOUT
N$8
  Top 0.203: LED7.4-DIN 58.17,33.79 60.84,36.46 60.84,36.58 LED6.2-DOUT
N$9  (via drill 0.38)
  Top 0.203: v59.7,26.8 57.79,26.8 LED8.4-DIN | v60.97,27.44 61.22,27.69 61.22,28.71 LED7.2-DOUT
  Bottom 0.203: v59.7,26.8 60.33,27.44 v60.97,27.44
N$10
  Top 0.203: LED9.4-DIN 55.76,20.07 59.57,20.07 59.57,21.09 LED8.2-DOUT
N$11
  Top 0.203: LED10.4-DIN 51.82,14.11 51.19,14.74 51.19,18.8 52.84,20.45 54.62,20.45 54.62,16.39 56.02,14.99 56.02,14.11 LED9.2-DOUT
N$12
  Top 0.203: LED11.4-DIN 46.74,9.28 45.22,10.8 45.22,11.82 47,13.6 50.68,13.6 50.68,8.26 LED10.2-DOUT
N$13
  Top 0.203: LED11.2-DOUT 44.08,4.07 40.65,4.07 40.65,5.98 LED12.4-DIN
N$14
  Top 0.203: LED12.2-DOUT 36.58,1.66 33.79,4.45 LED13.4-DIN
N$15
  Top 0.203: LED14.4-DIN 26.8,4.71 28.71,2.8 28.71,1.28 LED13.2-DOUT
N$16
  Top 0.203: LED15.4-DIN 20.07,6.74 20.71,6.1 20.71,3.31 21.09,2.93 LED14.2-DOUT
N$17
  Top 0.203: LED16.4-DIN 14.11,10.55 14.11,6.48 LED15.2-DOUT
N$18
  Top 0.203: LED16.2-DOUT 8.26,11.82 9.15,12.71 9.15,15.63 LED17.4-DIN
N$19
  Top 0.203: LED17.2-DOUT 4.07,18.42 5.72,20.07 5.72,21.6 5.98,21.85 LED18.4-DIN
N$20
  Top 0.203: LED18.2-DOUT 1.66,25.92 4.33,28.58 4.33,28.71 LED19.4-DIN
N$21  (via drill 0.38)
  Top 0.203: v1.53,35.06 1.53,34.04 1.28,33.79 LED19.2-DOUT | v3.56,35.06 4.71,35.06 4.71,35.7 LED20.4-DIN
  Bottom 0.203: v3.56,35.06 v1.53,35.06
N$22
  Top 0.203: LED20.2-DOUT 2.93,41.41 5.47,41.41 5.47,41.54 6.36,42.43 6.74,42.43 LED21.4-DIN
N$23
  Top 0.203: LED21.2-DOUT 6.48,48.39 10.55,48.39 LED22.4-DIN
N$24  (via drill 0.38)
  Top 0.203: v13.72,53.35 15.63,53.35 LED23.4-DIN | v12.45,53.6 11.82,54.24 LED22.2-DOUT
  Bottom 0.203: v13.72,53.35 13.47,53.6 v12.45,53.6
N$25
  Top 0.203: LED23.2-DOUT 18.42,58.43 21.85,58.43 21.85,56.52 LED24.4-DIN
N$27
  Top 0.203: R5.2 25.92,29.6 28.71,29.6 LED25.4-DIN
N$28
  Top 0.203: 48.2,37.28 48.14,37.35 48.14,37.98 L2.2 | 48.2,37.28 49.03,36.46 C6.1 | U4.20 45.17,36.98 47.67,36.97 48.14,37.22 48.2,37.28
N$29
  Top 0.203: U4.3 40.01,37.98 35.19,37.98 35.19,40.77 34.3,41.66 34.3,44.59 33.66,45.22 31.89,45.22 31.89,40.77 C11.1
N$30  (via drill 0.38)
  Top 0.203: v35.82,39.38 35.82,38.49 40.01,38.49 U4.2 | v28.46,39.63 27.31,39.63 27.31,40.52 C10.1
  Bottom 0.203: v35.82,39.38 28.71,39.38 v28.46,39.63
N$31
  Top 0.203: U4.28 42.89,39.77 42.81,40.9 42.05,41.66 42.05,43.19 42.68,43.82 Y2.3 42.68,43.95 42.68,46.49 C13.1
N$32
  Top 0.203: U4.27 43.42,39.68 43.4,40.27 43.19,40.52 43.19,41.41 43.95,42.17 Y2.1 44.08,42.3 44.71,42.93 44.71,44.97 45.73,45.98 C12.1
N$33  (via drill 0.38)
  Top 0.203: v34.55,40.01 34.55,37.5 39.99,37.49 U4.4 | v29.34,42.17 28.71,42.81 Y3.2 | v22.61,39.25 22.61,34.68 20.96,33.03 C14.2
  Bottom 0.203: v34.55,40.01 32.39,42.17 v29.34,42.17 25.54,42.17 v22.61,39.25
N$34  (via drill 0.38)
  Top 0.203: U4.5 39.97,36.98 v33.92,36.96 33.92,42.81 33.03,43.7 Y3.1 | v25.92,35.95 20.84,30.87 C15.2
  Bottom 0.203: v25.92,35.95 27.03,36.99 v33.92,36.96
N$35  (via drill 0.38)
  Top 0.203: v40.83,40.98 40.83,39.84 U4.32 | v35.95,45.73 35.82,45.86 35.82,46.74 L4.1
  Bottom 0.203: v35.95,45.73 v40.83,40.98
N$36
  Top 0.203: U4.25 44.46,39.76 47.25,42.55 47.25,43.57 R1.1
N$37
  Top 0.203: L4.2 35.82,48.27 38.11,48.27 38.11,47.89 L5.1
N$38  (via drill 0.38)
  Top 0.203: U4.22 45.22,37.98 46.36,37.98 L1.2 48.14,39.89 48.14,40.52 v48.01,40.65 | v48.01,44.84 48.01,46.36 L3.1
  Bottom 0.203: v48.01,40.65 v48.01,44.84
N$39
  Top 0.203: 49.16,38.62 L1.1 | 49.16,38.62 49.16,38.11 L2.1 | 49.16,38.62 47.63,38.62 47.51,38.49 47.51,37.52 45.23,37.52 U4.21
N$40  (via drill 0.38)
  Top 0.203: v45.22,49.66 27.95,49.66 C21.2 | v47.25,48.14 47.89,47.51 L3.2
  Bottom 0.203: v45.22,49.66 46.74,48.14 v47.25,48.14
N$41
  Top 0.203: C22.2 26.68,48.9 26.3,48.9 U$77.FEED | C21.1 26.8,49.79 26.3,49.79 U$77.FEED | C23.2 26.93,48.01 26.3,48.01 U$77.FEED
N$42  (via drill 0.38)
  Top 0.203: v22.49,53.48 20.58,53.48 R4.2 | v27.69,57.03 28.71,58.05 LED1.4-DIN
  Bottom 0.203: v22.49,53.48 26.04,57.03 v27.69,57.03
RDYN  (via drill 0.38)
  Top 0.203: 48.59,22.8 49.54,21.85 R2.1 | 48.59,22.8 48.52,22.87 48.52,30.61 44.46,34.68 U4.16 | v30.36,15.12 24.01,15.12 U1.32 | 48.59,22.8 v48.27,22.49
  Bottom 0.203: v30.36,15.12 35.95,20.71 46.49,20.71 v48.27,22.49
REQN
  Top 0.203: U4.12 42.43,34.68 42.43,28.2 43.06,27.57 43.06,27.19 U6.4
REQN_5V  (via drill 0.38)
  Top 0.203: v42.3,26.04 42.3,26.93 42.43,27.06 U6.5 | v20.84,24.52 20.07,23.76 20.07,23.12 U1.14
  Bottom 0.203: v42.3,26.04 40.77,24.52 v20.84,24.52
RESET  (via drill 0.38)
  Top 0.203: v45.86,34.17 45.86,36.46 45.22,36.46 U4.19 | v45.47,25.92 41.28,21.73 41.28,21.34 U6.10
  Bottom 0.203: v45.86,34.17 45.86,25.92 v45.47,25.92
RESET_5V  (via drill 0.38)
  Top 0.203: v36.84,21.34 40.52,21.34 U6.9 | v21.6,21.6 20.84,22.36 20.84,22.99 U1.13
  Bottom 0.203: v36.84,21.34 36.58,21.6 v21.6,21.6
RESET_ISP  (via drill 0.38)
  Top 0.203: R3.1 27.31,11.06 21.6,11.06 21.6,14.99 U1.29 21.47,15.12 v21.47,18.3 | v13.98,25.79 13.98,38.36 12.84,39.51 J4.5
  Bottom 0.203: v21.47,18.3 v13.98,25.79
SCK
  Top 0.203: U4.11 41.92,34.68 41.92,27.19 U6.6
SCK_5V  (via drill 0.38)
  Top 0.203: v41.03,28.2 41.03,27.31 41.16,27.19 U6.7 | v17.28,33.28 17.28,21.85 U1.17
  Bottom 0.203: v41.03,28.2 35.95,33.28 v17.28,33.28 11.82,33.28 11.57,33.54 11.57,35.7 12.84,36.97 J4.3
VDD  (via drill 0.38)
  Top 0.203: R2.2 49.66,23.63 50.68,22.61 50.68,20.84 48.65,20.84 47.63,21.85 47.63,24.65 45.22,27.06 U6.1 45.09,27.19 44.97,27.31 v44.97,32.14 | C24.1 17.66,39 20.58,39 C19.1 20.71,39 21.98,39 v21.98,38.62 | 40.9,34.81 U4.9 40.9,34.68 v40.9,33.79 | 40.14,39 U4.1 40.01,39 36.71,39 v36.71,39.12 | v33.28,38.74 32.14,38.74 32.14,38.62 | 32.14,38.62 32.14,38.49 C18.1 32.14,38.62 | v24.14,39.89 24.14,41.16 23.76,41.54 U5.5 | 32.14,38.62 31,39.76 31,44.97 32.65,46.62 FB1.1
  Bottom 0.203: 36.39,38.81 36.33,38.74 v33.28,38.74 25.28,38.74 v24.14,39.89 24.14,39.76 22.99,38.62 v21.98,38.62 | 36.39,38.81 v36.71,39.12 | v40.9,33.79 41.54,33.16 43.82,33.16 43.89,33.22 | 43.89,33.22 44.2,33.54 44.2,38.74 36.46,38.74 36.39,38.81 | 43.89,33.22 v44.97,32.14
VIN  (via drill 0.38)
  Top 0.203: C20.1 21.73,51.06 23.63,49.16 23.63,44.33 U5.1 23.63,44.2 23.63,43.31 22.36,43.31 22.11,43.57 21.84,43.91 21.85,44.2 U5.3 21.73,44.33 v20.96,45.09 | v14.61,30.74 14.61,43.44 U3.1 14.61,43.57 v16.14,45.09
  Bottom 0.203: v14.61,30.74 10.42,30.74 BAT.1 | v16.14,45.09 v20.96,45.09
(copper drawn outside any net)
  shapes: Bottom area x1